# EAGLE design 2DD-17-mk-1.4 (EAGLE 7.5.0)
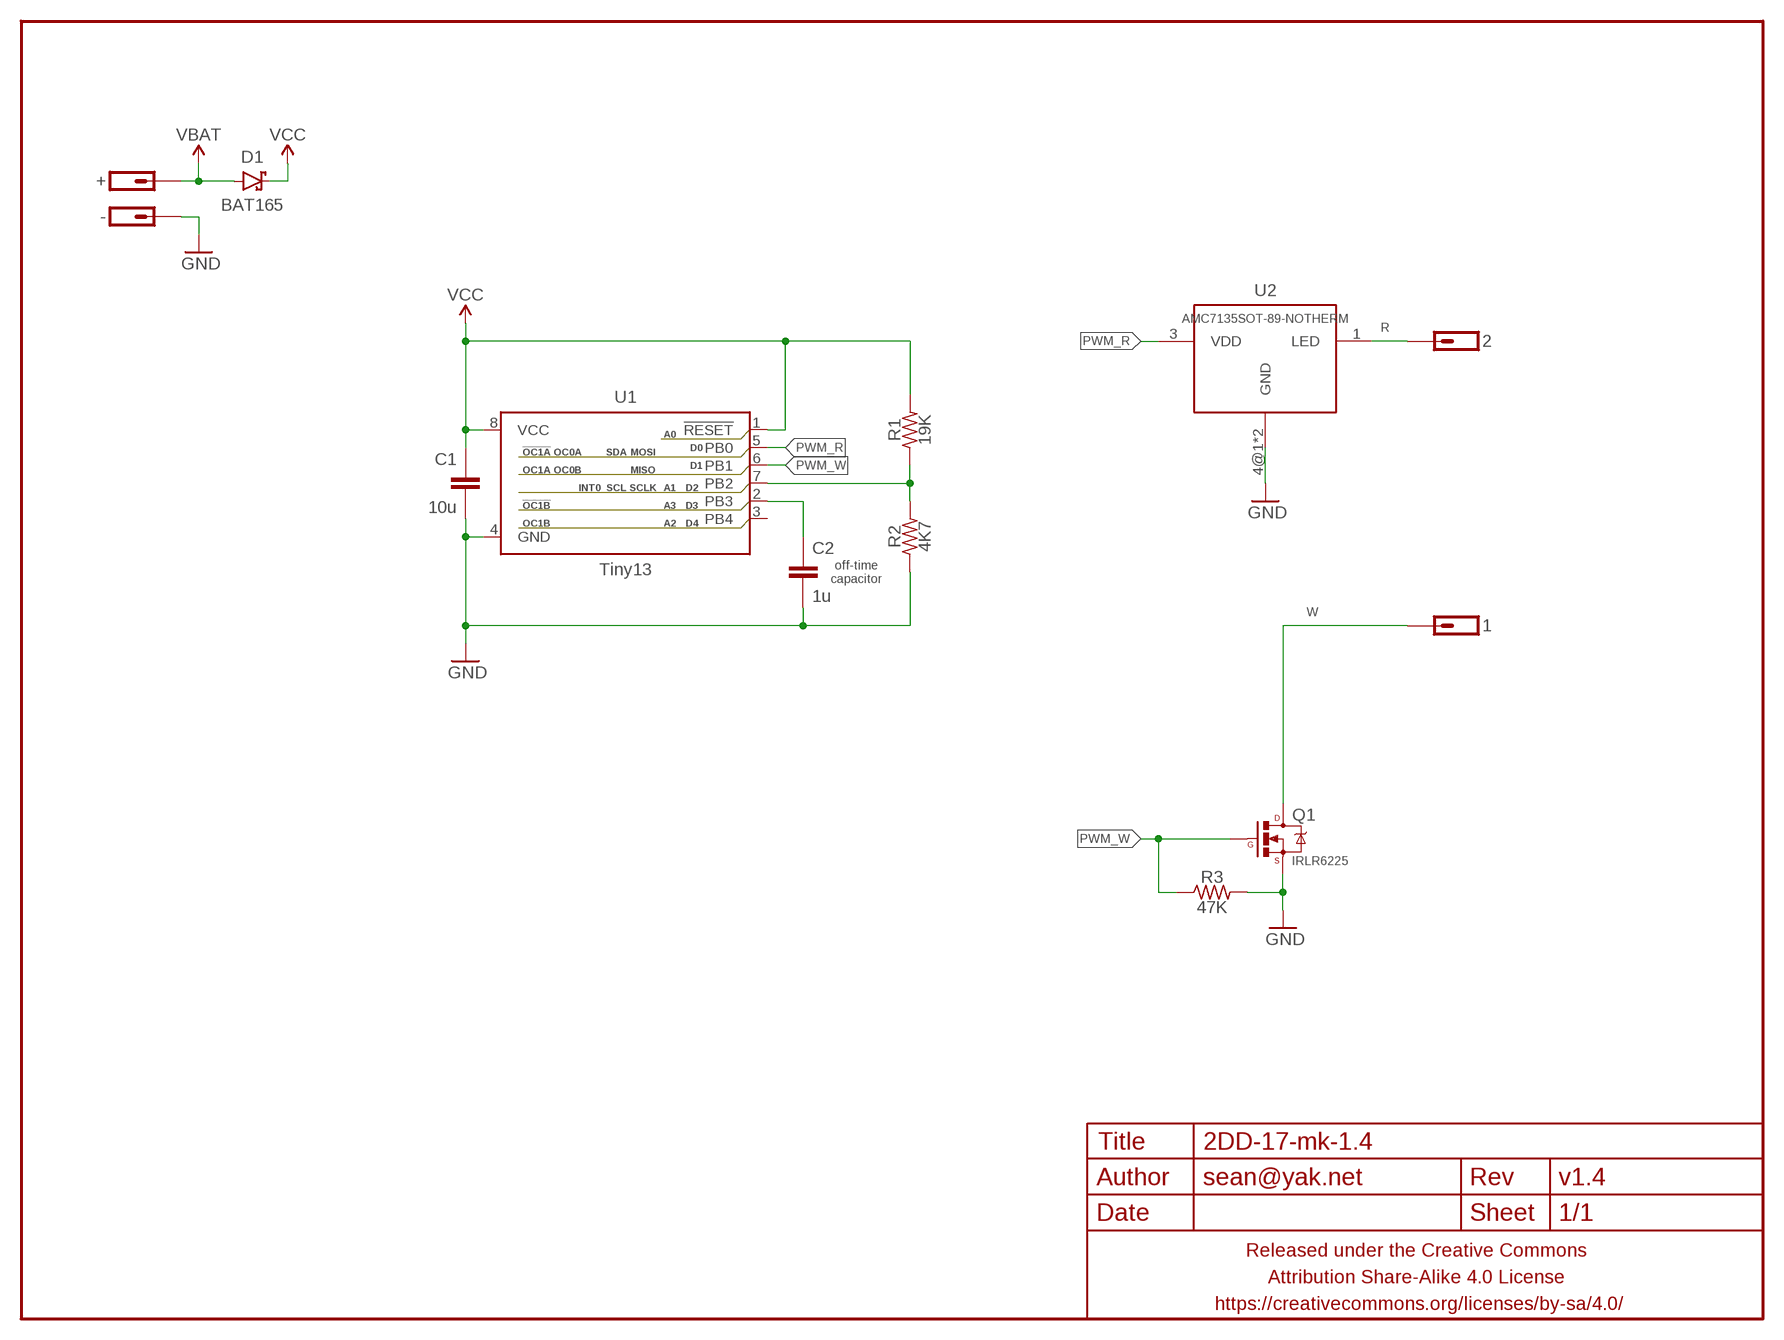
[diagram p0: schematic, sheet 1]

## Parts
1  M01PTH-1MM-CIR-NS  [1X01-1MM-CIR-NS]
2  M01SMD-1.25MM-DIA  [1X01-SMD-1.25MM-DIA-NS]
+  M01PTH-1MM-CIR-NS  [1X01-1MM-CIR-NS]
-  M01NOT-A-VIA-NOPE  [1X01_NOSILK_NOSTOP]
C1  10u  CAPACITOR-CERAMICC0603-TIGHTER  [C0603-TIGHTER]
C2  1u  CAPACITOR-CERAMICC0402  [C0402]
D1  BAT165  DIODE-SCHOTTKYSOD323  [SOD323-SCHOTTKY]
FRAME1  FRAME-LETTERNO_PACKAGE  [DUMMY]
Q1  IRLR6225  MOSFET-NCHANNELSOT-223-CLOSER  [SOT223-CLOSER]
R1  19K  RESISTORR0603-TIGHTER  [R0603-TIGHTER]
R2  4K7  RESISTORR0603-TIGHTER  [R0603-TIGHTER]
R3  47K  RESISTORR0603-TIGHTER  [R0603-TIGHTER]
U1  Tiny13  ATTINY13SOIC-NARROWPADS  [SO08-NARROWER]
U2  AMC7135SOT-89-NOTHERM  [SOT89-NOTHERM]

## Nets
GND: -.P$1 C1.2 C2.2 Q1.3(S) R2.1 R3.2 U1.4(GND) U2.4@1(GND) U2.4@2(GND)
N$1: R1.1 R2.2 U1.7(PB2)
N$2: C2.1 U1.2(PB3)
PWM_R: U1.5(PB0) U2.3(VDD)
PWM_W: Q1.1(G) R3.1 U1.6(PB1)
R: 2.P$1 U2.1(LED)
VBAT: +.1 D1.A
VCC: C1.1 D1.C R1.2 U1.1(!RESET) U1.8(VCC)
W: 1.1 Q1.2(D) Q1.4(D)
Unconnected: U1.3(PB4)

## Notes on the sheet
- off-time
  capacitor

## Library data of the parts
1 2 + - = a_parts:M01: Header 1 Standard 1-pin 0.1" header. Use with straight break away headers (SKU : PRT-00116), right angle break away headers (PRT-00553), swiss pins (PRT-00743), machine pins (PRT-00117), and female headers (PRT-00115).
C1 C2 = a_parts:CAPACITOR-CERAMIC: CAPACITOR, European symbol
D1 = a_parts:DIODE-SCHOTTKY: Schottky diodes in SFE's production catalog BAT20J 1A 23V 0.62Vf RB751 120mA 40V 0.37Vf PMEG4005EJ 0.5A 40V 0.42Vf MBRA140 1A 40V 0.5Vf B340A 3A 40V SMA
FRAME1 = a_parts:FRAME-LETTER: Schematic Frame Standard 8.5x11 US Letter frame; DESIGNER: sean@yak.net; VERSION: v1.4
Q1 = a_parts:MOSFET-NCHANNEL: Common NMOSFET Parts MFG P/N Store ID Prod ID FDD8780 TRANS-09984 SI7820DN TRANS-11055 FDS6630A IC-08089 2N7002PW TRANS-11151 FQP30N06L COM-10213 TRANS-10060 BSS123LT1G TRANS-08345 BSS138 TRANS-00830 BS170 2N7000
R1-R3 = a_parts:RESISTOR: RESISTOR, American symbol
U1 = a_parts:ATTINY13: Atmel 8-pin 1kB flash uC
U2 = a_parts:AMC7135

## Board
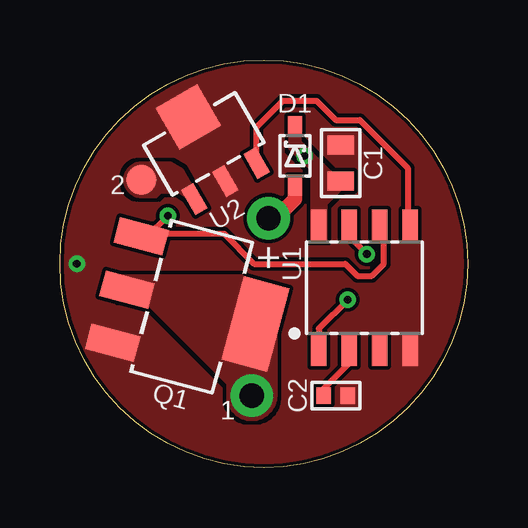
[diagram p1: board, top side]
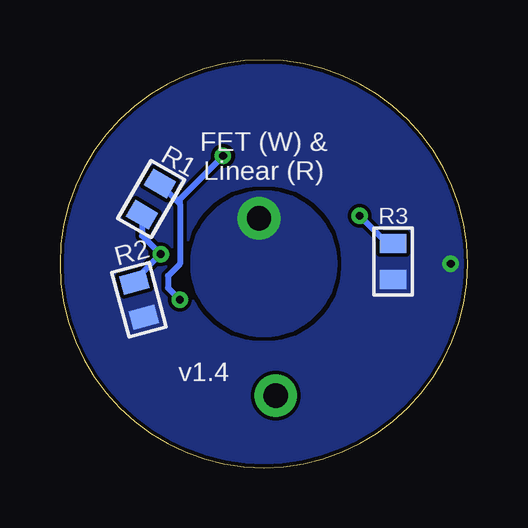
[diagram p2: board, bottom side, seen from below]

Size 17 x 17 mm. Coordinates in mm from the lower left corner, seen from the top.
Outline: 0,8.5 arc-180 17,8.5 arc-180 0,8.5
Copper layers (1*16): Top 0.0356mm / dielectric 1.5011mm / Bottom 0.0356mm
Design rules "LaenPCBOrder2 *": minimum track width 6mil, minimum drill 13mil, track to track 6mil, track to pad 6mil, pad to pad 6mil, via to via 6mil, smd to smd 6mil, copper to edge 6mil, drill to drill 6mil, minimum pad ring 7mil, minimum via ring 7mil, stop-mask expansion 3mil, vias tented up to drill 20mil, thermal gap 10mil

### Footprints (pad centres in the part's own frame; a part is rotated, then mirrored left to right if it is on the bottom)
1X01-1MM-CIR-NS = drill 1.016 pad 1.778: 1 0,0
1X01-SMD-1.25MM-DIA-NS = smd 1.25 x 1.25: P$1 0,0
1X01_NOSILK_NOSTOP = drill 0.33: P$1 0,0
C0603-TIGHTER = smd 0.8 x 1.1: 1 -0.75,0; 2 0.75,0
C0402 = smd 0.6 x 0.7: 1 -0.5,0; 2 0.5,0
SOD323-SCHOTTKY = smd 0.8 x 0.6: A -1.25,0; C 1.25,0
SOT223-CLOSER = smd 1.1 x 2.1: 1 -2.3,-2.8; 2 0,-2.8; 3 2.3,-2.8 | smd 3.6 x 1.95: 4 0,2.75
R0603-TIGHTER = smd 0.8 x 1.1: 1 -0.75,0; 2 0.75,0
SO08-NARROWER = smd 0.635 x 1.27: 1 -1.905,-2.616; 2 -0.635,-2.616; 3 0.635,-2.616; 4 1.905,-2.616; 5 1.905,2.616; 6 0.635,2.616; 7 -0.635,2.616; 8 -1.905,2.616
SOT89-NOTHERM = smd 0.58 x 1.2: 1 -1.5,-1.8; 3 1.5,-1.8; 4@1 0,-1.8 | smd 2 x 2: 4@2 0,1.3

### Placement (x,y rotation side)
1  8,3 270 top
2  3.4,12 0 top
+  8.7,10.4 180 top
-  0.7,8.5 90 bottom
C1  11.7,12.7 90 top
C2  11.5,3 0 top
D1  9.8,13 90 top
FRAME1  0,0 0 top
Q1  5.5,6.7 255 top
R1  13.2,11.2 60 bottom
R2  13.7,7 105 bottom
R3  3.1,8.6 270 bottom
U1  12.7,7.5 0 top
U2  6,13.5 30 top

### Tracks (layer width: path | path; a pad name or v marks a point on that pad's centre or on a via)
GND
  pour Top (isolate 0.152, rank 6, no thermals): 0,0 17,0 17,17 0,17
  pour Bottom (isolate 0.152, rank 6, no thermals): 0,0 0,17 17,17 17,0
N$1  (via drill 0.33)
  Top 0.25: U1.7 12.06,9.63 v12.8,8.9
  Bottom 0.25: R1.1 13.57,9.68 v12.8,8.9 13.89,7.81 R2.2
N$2
  Top 0.25: U1.2 12.06,4.37 11,3.3 C2.1
PWM_R
  Top 0.25: U2.3 8.2,14.2 9.3,15.3 10.7,15.3 11.5,14.5 12.5,14.5 14.5,12.5 14.5,10.22 U1.5
PWM_W  (via drill 0.33)
  Top 0.25: U1.6 13.5,9.95 13.5,8.5 13,8 12.4,8 11.9,8.5 8.1,8.5 6.84,9.76 3.5,9.76 Q1.1 3.65,9.65 v4.5,10.5
  Bottom 0.25: R3.1 3.35,9.35 v4.5,10.5
R
  pour Top (isolate 0.152, no thermals): 5.5,11 5.9,11 5.1,12.4 4.6,12.7 3.4,12.7 arc180 3.4,11.3 4,11.3 4.2,11.5 5,11.5 5.3,11.3
VBAT
  Top 0.6: D1.A 9.8,11.2 9,10.4 +.1
  pour Bottom (isolate 0.152, no thermals): 5.5,8.5 arc-180 11.5,8.5 arc-180
VCC  (via drill 0.33)
  Top 0.25: v12,7 10.8,5.8 U1.1
  Bottom 0.25: R1.2 12.82,11.82 12,11 | 12,11 12,8.5 12.5,8 12.5,7.5 v12,7 | 12,11 12,11.2 v10.2,13
  pour Top (isolate 0.152, no thermals): 9.6,14.5 9.6,13.3 10.5,12.4 10.5,9.5 11.1,9.5 11.1,11 11.8,11.7 12.1,11.7 12.1,12.2 11.4,12.2 10,13.6 10,14.5
W
  pour Top (isolate 0.152, no thermals): 2.5,8 2,7.5 2.5,7 3.5,7 7,3.5 7,3 arc180 9,3 9,7.4 8.2,7.4 7.6,8

### Text on the board
bPlace: FET (W) & / Linear (R)